# Altium schematic sheet Sheet1.SchDoc: =title_line_1 + title_line_2
size 420 x 297 mm; SheetNumber: 3; SheetTotal: 3
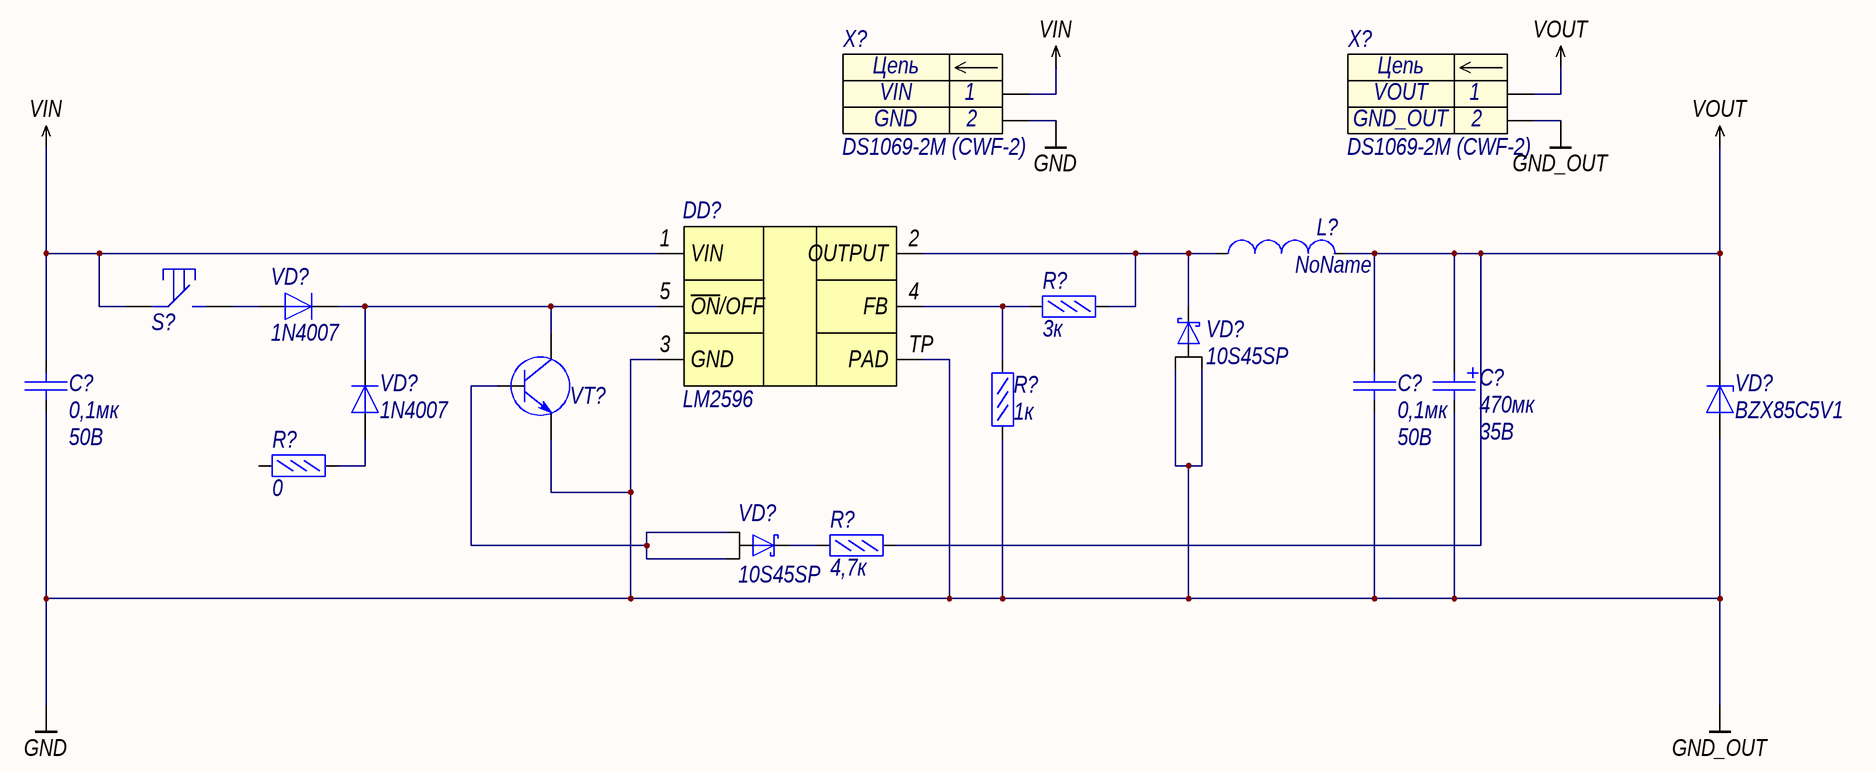
[diagram p0: Sheet1.SchDoc]

## Parts
(Parts that share a designator on the sheet are numbered #1, #2 ... from top to bottom, then left to right.)
C?#1  Voltage: 35В  [CAPALUM_10x12.5]  (hidden comment: 470мк)
C?#2  Voltage: 50В  [C0603]  (hidden comment: 0,1мк)
C?#3  Voltage: 50В  [C0603]  (hidden comment: 0,1мк)
DD?  LM2596  [D2PAK_5]
L?  NoName  [CDRH124]
R?#1  3к  [R0603]
R?#2  1к  [R0603]
R?#3  0  [R0603]
R?#4  4,7к  [R0603]
S?  IT-1187  [it-1187]  (value not drawn)
VD?#1  1N4007
VD?#2  10S45SP  [TO-277A]
VD?#3  1N4007
VD?#4  BZX85C5V1
VD?#5  10S45SP  [TO-277A]
VT?  BC847B  [SOT23-3]  (value not drawn)
X?#1  DS1069-2M (CWF-2)  [CWF-2]
X?#2  DS1069-2M (CWF-2)  [CWF-2]

## Nets
GND: C?#1.2 C?#2.1 C?#3.1 DD?.3(GND) DD?.TP(PAD) R?#2.1 VD?#2.1(A) VD?#2.2(A) VD?#4.1(A) VT?.2 X?#1.2 X?#2.2  [also labelled GND_OUT]
VIN: C?#2.2 DD?.1(VIN) S?.1 X?#1.1
VOUT: C?#1.1 C?#3.2 L?.2 R?#4.2 VD?#4.3(K) X?#2.1
NetDD?_2: DD?.2(OUTPUT) L?.1 R?#1.2 VD?#2.3(K)
NetDD?_4: DD?.4(FB) R?#1.1 R?#2.2
NetDD?_5: DD?.5(~{ON}/OFF) VD?#1.3(K) VD?#3.3(K) VT?.3
NetR?#3_2: R?#3.2 VD?#3.1(A)
NetR?#4_1: R?#4.1 VD?#5.3(K)
NetS?_2: S?.2 VD?#1.1(A)
NetVD?#5_1: VD?#5.1(A) VD?#5.2(A) VT?.1

Not connected (* = marked no-connect by the designer): R?#3 1

## Notes on the sheet
- Перв. примен.
- Справ. №
- Подп. и дата
- Инв. № дубл.
- Нормоконтроль:
- Взам. инв. №
- Изм.
- Лист
- № докум.
- Подп.
- Дата
- Лит.
- Масса
- Масштаб
- Т.контр.
- Пров.
- Разраб.
- Листов
- Разработал:
- Инв. № подл.
- Н.контр.
- Утв.
- Копировал
- Формат
- А3
- (in symbol CWF-2) Цепь

## Library data of the parts
C?#1 = SH035M0470B5s-1015: Конденсатор эл.лит. алюм. 470мкФ 35В; Manufacturer: EPCOS; Name: B41858C6157M; ESR: 0,3Ом; Value: 470мк
C?#2 C?#3 = CC0603JPX7R9BB104: Конденсатор кер. 0,1мкФ 50В; Manufacturer: Yageo; TKE: X7R; Name: CC0603JPX7R9BB104; Value: 0,1мк
DD? = LM2596: регулируемый стабилизатор напряжения; Name: LM2596
L? = NoName: Катушка с сердечником 47мкГн 0,8А; Name: CDRH124NP-4R7MC; Value: 47мк; I saturation: 5,7А; R: 0,014
R?#1 = RC0603FR-073KL: Резистор 3кОм 0,063Вт 1%; Manufacturer: YAGEO; Name: RC0603FR-073KL; Tolerance: 1%; Value: 3к
R?#2 = RC0603FR-071KL: Резистор 1кОм 0,063Вт 1%; Manufacturer: YAGEO; Name: RC0603FR-071KL; Tolerance: 1%; Value: 1к
R?#3 = Перемычка 0603: Name: Перемычка 0603; Value: 0
R?#4 = RC0603FR-074K7L: Резистор 4,7кОм 0,063Вт 1%; Manufacturer: YAGEO; Name: RC0603FR-074K7L; Tolerance: 1%; Value: 4,7к
S? = IT-1187: тактовая кнопка SMD; Name: IT-1187
VD?#1 VD?#3 = 1N4007: Диод выпрямиельный 1000В 1А; Name: 1N4007
VD?#2 VD?#5 = 10S45SP: Диод Шоттки 45В 10А; Manufacturer: YFW; Name: 10S45SP
VD?#4 = BZX85C5V1: Стабилитрон 5,1В; Name: BZX85C5V1
VT? = BC847B: Биполярный NPN транзистор 45В 100мА; Manufacturer: NXP Semiconductor; Name: BC847B
X?#1 = CWF-2: Разъем - 2 конт. прямая вилка на плату; Contact_1: VIN; Contact_2: GND; Name: DS1069-2M (CWF-2)
X?#2 = CWF-2: Разъем - 2 конт. прямая вилка на плату; Contact_1: VOUT; Contact_2: GND_OUT; Name: DS1069-2M (CWF-2)